# EAGLE schematic uuni (EAGLE 9.0.1)
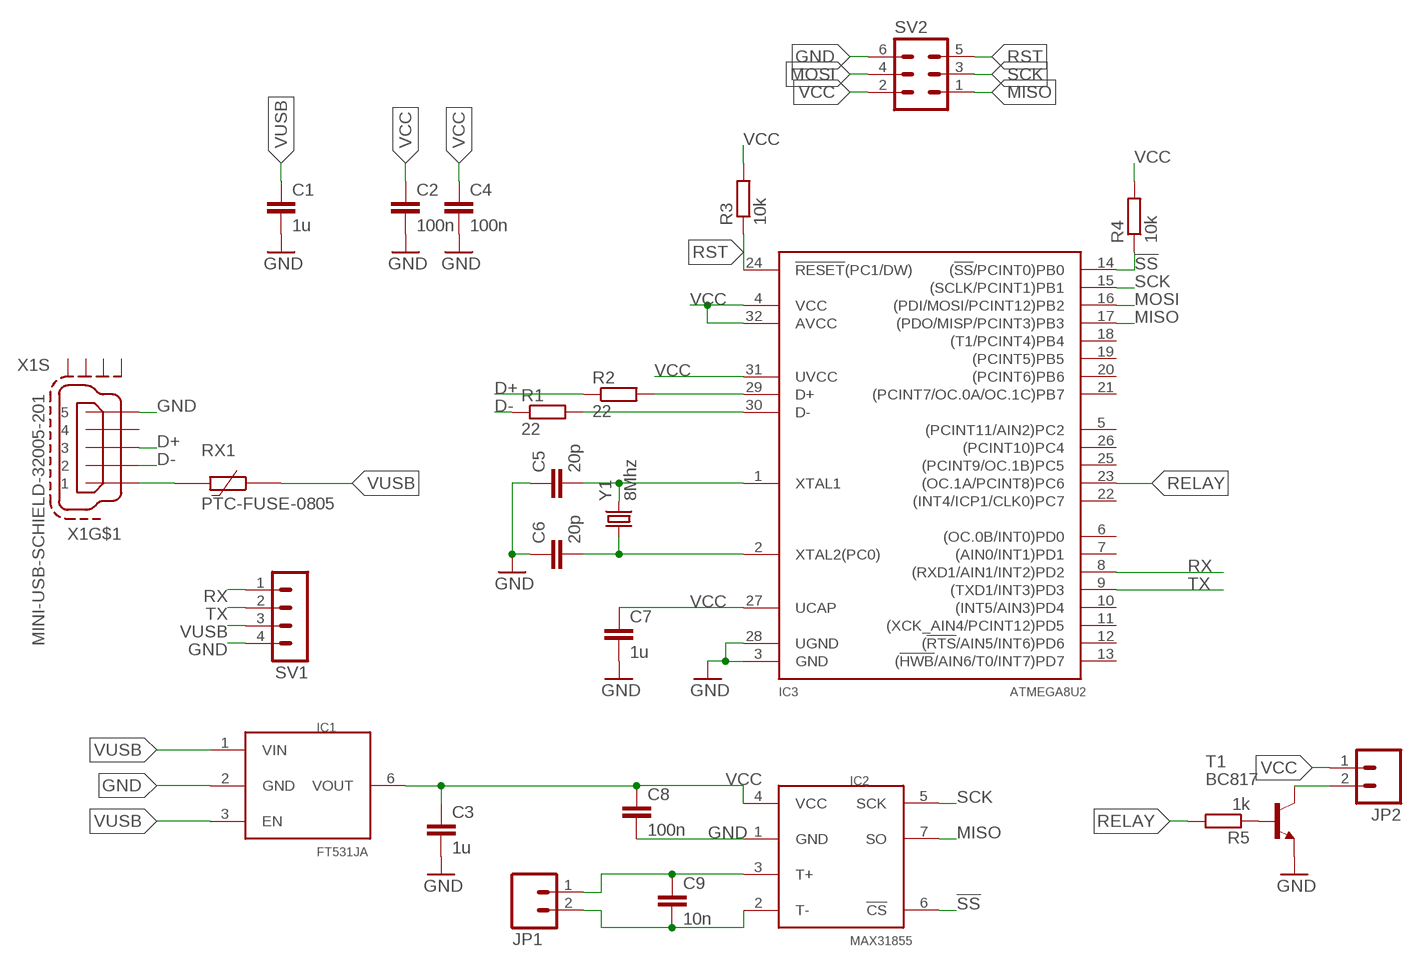
[diagram p0: schematic, sheet 1]

## Parts
C1  1u  C-EUC0603  [C0603]
C2  100n  C-EUC0603  [C0603]
C3  1u  C-EUC0603  [C0603]
C4  100n  C-EUC0603  [C0603]
C5  20p  C-EUC0603  [C0603]
C6  20p  C-EUC0603  [C0603]
C7  1u  C-EUC0603  [C0603]
C8  100n  C-EUC0603  [C0603]
C9  10n  C-EUC0603  [C0603]
IC1  FT531JA  [SC-74]
IC2  MAX31855  [SO8]
IC3  ATMEGA8U2  [TQFP32-08]
JP1  M025MM  [SCREWTERMINAL-5MM-2]
JP2  M02LOCK  [1X02_LOCK]
R1  22  R-EU_R0603  [R0603]
R2  22  R-EU_R0603  [R0603]
R3  10k  R-EU_R0603  [R0603]
R4  10k  R-EU_R0603  [R0603]
R5  1k  R-EU_R0603  [R0603]
RX1  PTC-FUSE-0805  [R0805]
SV1  MA04-1  [MA04-1]
SV2  MA03-2  [MA03-2]
T1  BC817  BC817-40-NPN-SOT23-BEC  [SOT23-BEC]
X1  MINI-USB-SCHIELD-32005-201  [32005-201]
Y1  8Mhz  CRYSTALSMD  [HC49UP]

## Nets
!SS: IC2.6(!CS) IC3.14((!SS!/PCINT0)PB0) R4.1
D+: R2.1 X1.3
D-: R1.1 X1.2
GND: C1.2 C2.2 C3.2 C4.2 C5.1 C6.1 C7.2 C8.2 IC1.2(GND) IC2.1(GND) IC3.3(GND) IC3.28(UGND) SV1.4 SV2.6 T1.E X1.5
MISO: IC2.7(SO) IC3.17((PDO/MISP/PCINT3)PB3) SV2.1
MOSI: IC3.16((PDI/MOSI/PCINT12)PB2) SV2.4
N$1: C5.2 IC3.1(XTAL1) Y1.2
N$2: C6.2 IC3.2(XTAL2(PC0)) Y1.1
N$3: C9.1 IC2.3(T+) JP1.1
N$4: C9.2 IC2.2(T-) JP1.2
N$5: IC3.29(D+) R2.2
N$6: IC3.30(D-) R1.2
N$7: RX1.1 X1.1
N$13: JP2.2 T1.C
N$14: R5.1 T1.B
RELAY: IC3.23((OC.1A/PCINT8)PC6) R5.2
RST: IC3.24(!RESET!(PC1/DW)) R3.1 SV2.5
RX: IC3.8((RXD1/AIN1/INT2)PD2) SV1.1
SCK: IC2.5(SCK) IC3.15((SCLK/PCINT1)PB1) SV2.3
TX: IC3.9((TXD1/INT3)PD3) SV1.2
VCC: C2.1 C3.1 C4.1 C7.1 C8.1 IC1.6(VOUT) IC2.4(VCC) IC3.4(VCC) IC3.27(UCAP) IC3.31(UVCC) IC3.32(AVCC) JP2.1 R3.2 R4.2 SV2.2
VUSB: C1.1 IC1.1(VIN) IC1.3(EN) RX1.2 SV1.3
Unconnected: IC3.5((PCINT11/AIN2)PC2) IC3.6((OC.0B/INT0)PD0) IC3.7((AIN0/INT1)PD1) IC3.10((INT5/AIN3)PD4) IC3.11((XCK_AIN4/PCINT12)PD5) IC3.12((!RTS!/AIN5/INT6)PD6) IC3.13((!HWB!/AIN6/T0/INT7)PD7) IC3.18((T1/PCINT4)PB4) IC3.19((PCINT5)PB5) IC3.20((PCINT6)PB6) IC3.21((PCINT7/OC.0A/OC.1C)PB7) IC3.22((INT4/ICP1/CLK0)PC7) IC3.25((PCINT9/OC.1B)PC5) IC3.26((PCINT10)PC4) X1.4 X1.M1(S:S1) X1.M2(S:S2) X1.M3(S:S3) X1.M4(S:S4)

## Library data of the parts
C1-C9 = rcl:C-EU: CAPACITOR, European symbol
IC1 = uuni:FT531JA
IC2 = uuni:MAX31855
IC3 = hf:ATMEGA8U2: Atmel ATMEGA8U2 microprocessor in TQFP32 package
JP1 JP2 = uuni:M02: Header 2 Standard 2-pin 0.1" header. Use with straight break away headers (SKU : PRT-00116), right angle break away headers (PRT-00553), swiss pins (PRT-00743), machine pins (PRT-00117), and female headers (PRT-00115). Molex polarized connector foot print use with SKU : PRT-08233 with associated crimp pins and housings.
R1-R5 = rcl:R-EU_: RESISTOR, European symbol
RX1 = hf:PTC-FUSE-0805: PTC Dummy
SV1 = con-lstb:MA04-1: PIN HEADER; OC_FARNELL: unknown; OC_NEWARK: unknown
SV2 = uuni:MA03-2: PIN HEADER; OC_FARNELL: unknown; OC_NEWARK: unknown
T1 = transistor:*-NPN-: NPN Transistror BF959 corrected 2008.03.06
X1 = hf:MINI-USB-SCHIELD-: MINI USB-B Conector Source: www.cypressindustries.com; OC_FARNELL: unknown; OC_NEWARK: unknown
Y1 = SparkFun-FreqCtrl:CRYSTAL: Various standard crystals. Proven footprints. Spark Fun Electronics SKU : COM-00534